# Altium schematic sheet FPGA_BANK_A.SchDoc
size A3; Organization: ICNS, MARCS Institute; Address1: Werrington South Campus, Great Western Highway; Address2: Werrington, NSW, 2747; SheetNumber: 3; SheetTotal: 16
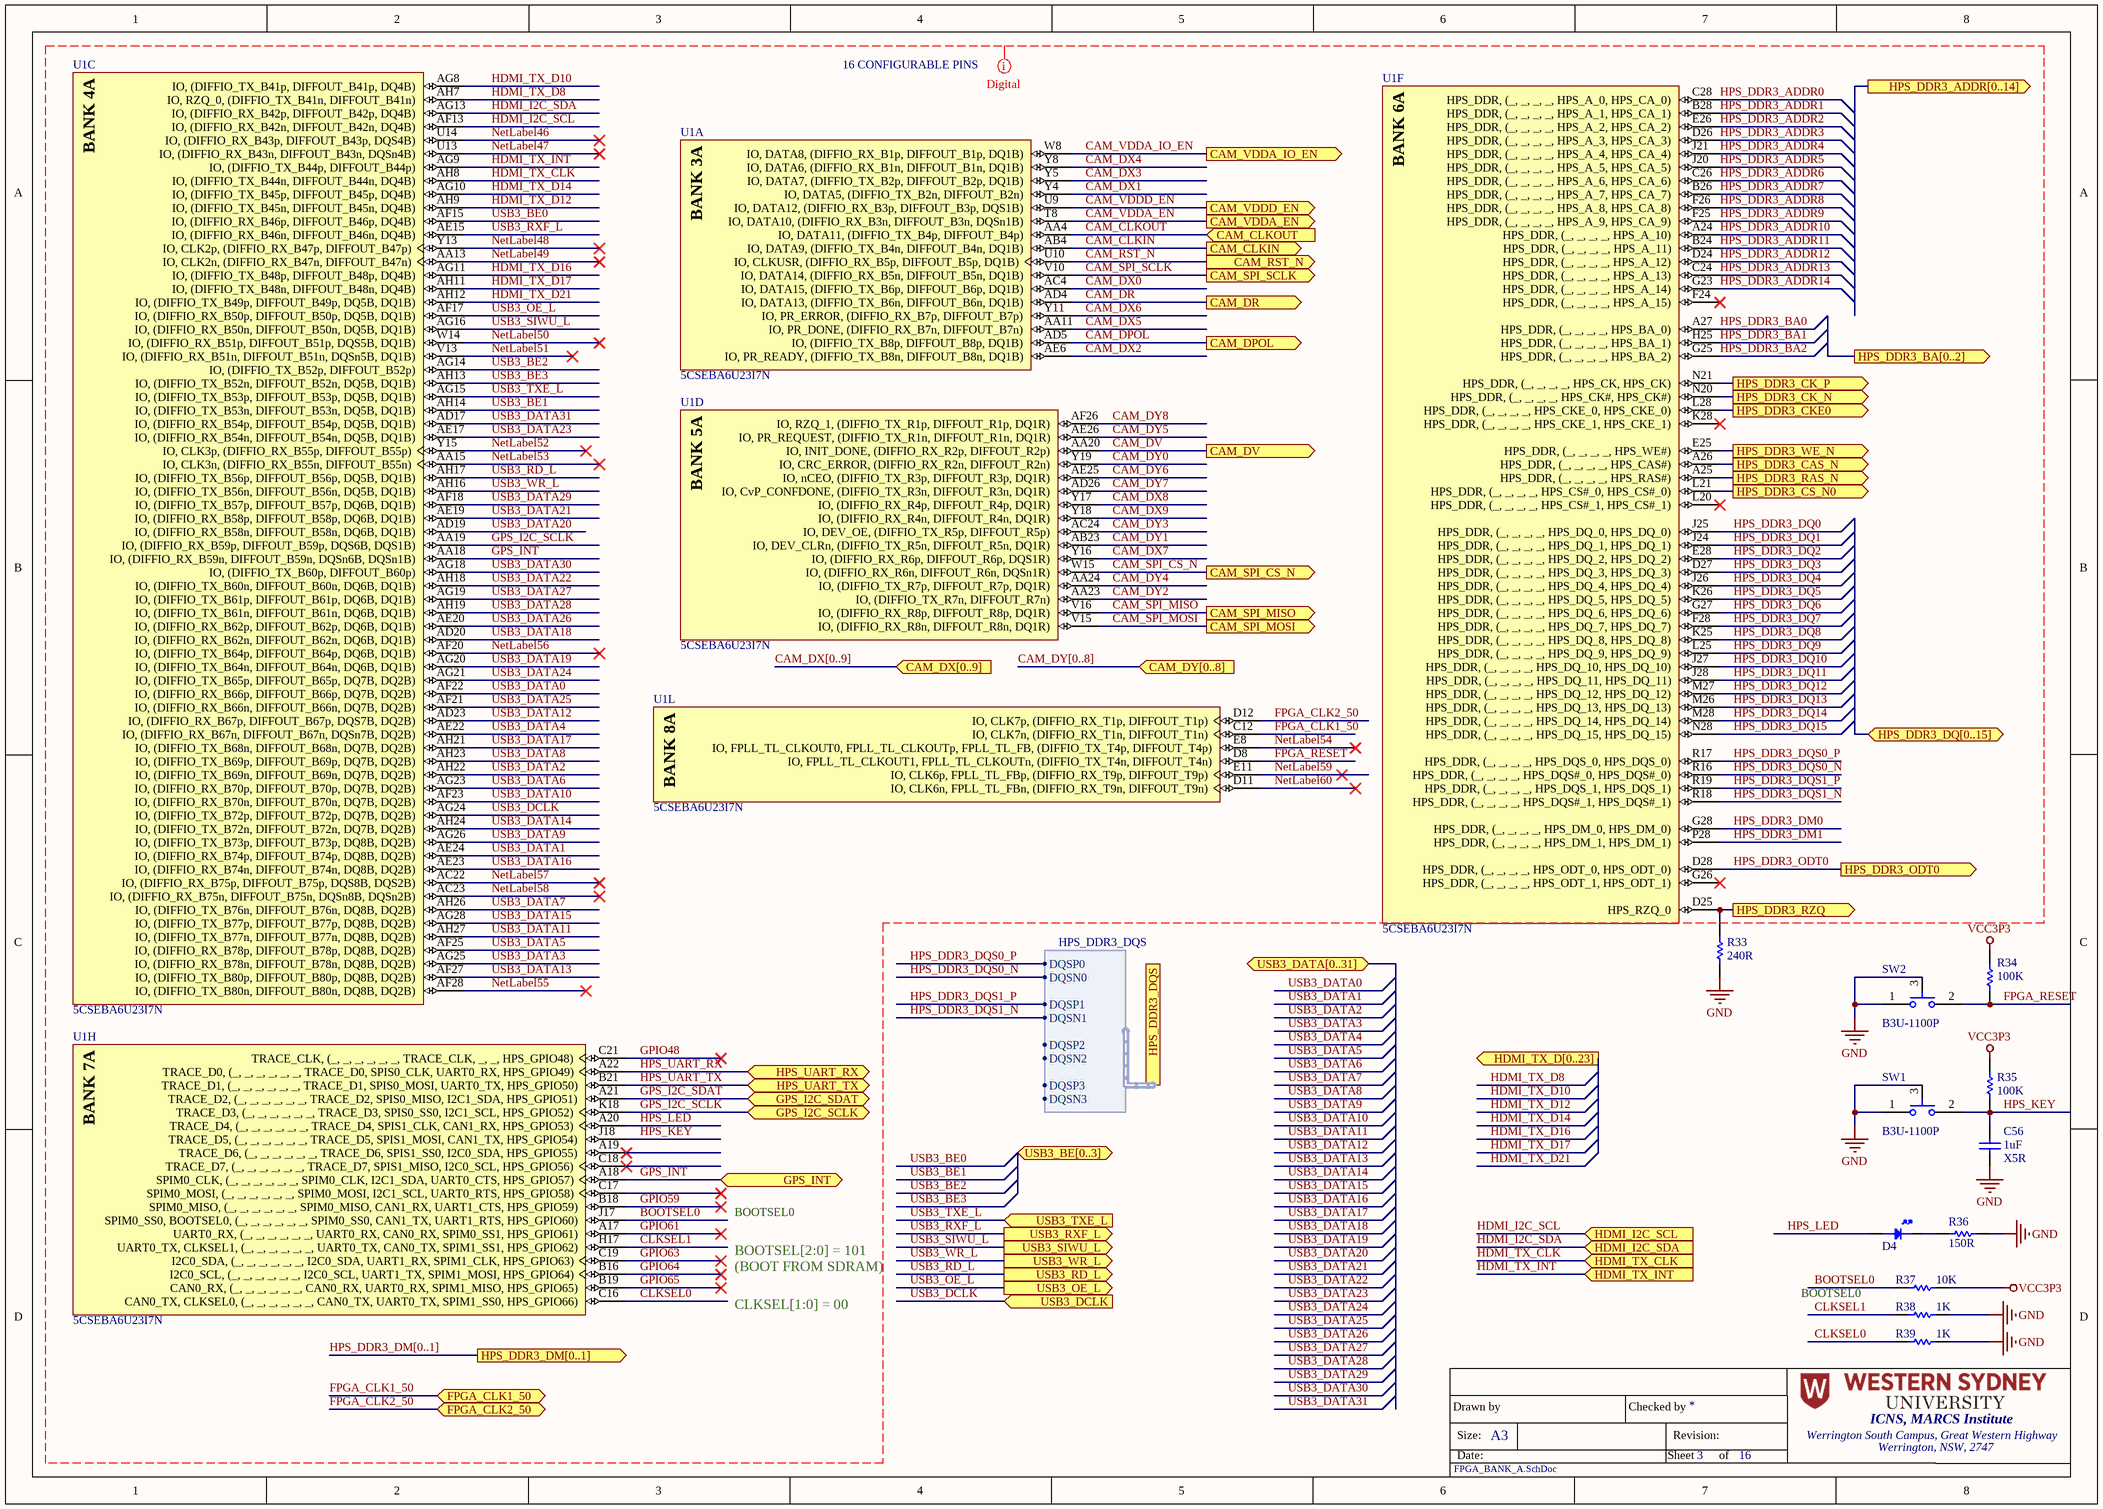
[diagram p0: FPGA_BANK_A.SchDoc]

## Parts
C56  value 1uF  Dielectric: X5R  [CAP 0201 (0603)]  (hidden comment: CL03A105KP3NSNC)
D4  150060SS75000  [DIOC 0603 (1608)]  (value not drawn)
R33  value 240R  [RES 0201 (0603)]  (hidden comment: AC0201FR-07240RL)
R34  value 100K  [RES 0402 (1005)]  (hidden comment: CRCW0402100KFKEDHP)
R35  value 100K  [RES 0402 (1005)]  (hidden comment: CRCW0402100KFKEDHP)
R36  Resistance: 150R  [RES 0603 (1608)]  (hidden comment: AC0603FR-10150RL)
R37  value 10K  [RES 0201 (0603)]  (hidden comment: AC0201FR-0710KL)
R38  value 1K  [RES 0201 (0603)]  (hidden comment: AC0201FR-071KL)
R39  value 1K  [RES 0201 (0603)]  (hidden comment: AC0201FR-071KL)
SW1  B3U-1100P  [FP-B3U-1100P-MFG]
SW2  B3U-1100P  [FP-B3U-1100P-MFG]
U1  5CSEBA6U23I7N  [ALTR-UBGA672_A-185]  (parts A,C,D,F,H,L of 21)

## Ports
CAM_CLKIN (out), CAM_CLKOUT (in), CAM_DPOL (out), CAM_DR (out), CAM_DV (out), CAM_DX[0..9] (in), CAM_DY[0..8] (in), CAM_RST_N (out), CAM_SPI_CS_N (out), CAM_SPI_MISO (out), CAM_SPI_MOSI (out), CAM_SPI_SCLK (out), CAM_VDDA_EN (out), CAM_VDDA_IO_EN (out), CAM_VDDD_EN (out), FPGA_CLK1_50 (bidir), FPGA_CLK2_50 (bidir), GPS_I2C_SCLK (bidir), GPS_I2C_SDAT (bidir), GPS_INT (bidir), HDMI_I2C_SCL (in), HDMI_I2C_SDA (in), HDMI_TX_CLK (in), HDMI_TX_D[0..23] (out), HDMI_TX_INT (in), HPS_DDR3_ADDR[0..14] (out), HPS_DDR3_BA[0..2] (out), HPS_DDR3_CAS_N (out), HPS_DDR3_CK_N (out), HPS_DDR3_CK_P (out), HPS_DDR3_CKE0 (out), HPS_DDR3_CS_N0 (out), HPS_DDR3_DM[0..1] (out), HPS_DDR3_DQ[0..15] (bidir), HPS_DDR3_DQS (harness HPS_DDR3_DQS), HPS_DDR3_ODT0 (out), HPS_DDR3_RAS_N (out), HPS_DDR3_RZQ (out), HPS_DDR3_WE_N (out), HPS_UART_RX (bidir), HPS_UART_TX (bidir), USB3_BE[0..3] (bidir), USB3_DATA[0..31] (bidir), USB3_DCLK (in), USB3_OE_L (out), USB3_RD_L (out), USB3_RXF_L (out), USB3_SIWU_L (out), USB3_TXE_L (in), USB3_WR_L (out)

## Harnesses
HPS_DDR3_DQS: DQSP0, DQSP1, DQSP2, DQSP3, DQSN0, DQSN1, DQSN2, DQSN3

## Nets
GND: C56.1 R33.2 R36.1 R38.2 R39.2 SW1.1 SW1.3 SW2.1 SW2.3
VCC3P3: R34.2 R35.2 R37.1
BOOTSEL0: R37.2 U1.J17(SPIM0_SS0,_BOOTSEL0,_(_,__,__,__,__,__,_SPIM0_SS0,_CAN1_TX,_UART1_RTS,_HPS_GPIO60))
CAM_CLKIN: U1.AB4(IO,_DATA9,_(DIFFIO_TX_B4n,_DIFFOUT_B4n,_DQ1B)) ; port CAM_CLKIN
CAM_CLKOUT: U1.AA4(IO,_DATA11,_(DIFFIO_TX_B4p,_DIFFOUT_B4p)) ; port CAM_CLKOUT
CAM_DPOL: U1.AD5(IO,_(DIFFIO_TX_B8p,_DIFFOUT_B8p,_DQ1B)) ; port CAM_DPOL
CAM_DR: U1.AD4(IO,_DATA13,_(DIFFIO_TX_B6n,_DIFFOUT_B6n,_DQ1B)) ; port CAM_DR
CAM_DV: U1.AA20(IO,_INIT_DONE,_(DIFFIO_RX_R2p,_DIFFOUT_R2p)) ; port CAM_DV
CAM_DX0: U1.AC4(IO,_DATA15,_(DIFFIO_TX_B6p,_DIFFOUT_B6p,_DQ1B))
CAM_DX1: U1.Y4(IO,_DATA5,_(DIFFIO_TX_B2n,_DIFFOUT_B2n))
CAM_DX2: U1.AE6(IO,_PR_READY,_(DIFFIO_TX_B8n,_DIFFOUT_B8n,_DQ1B))
CAM_DX3: U1.Y5(IO,_DATA7,_(DIFFIO_TX_B2p,_DIFFOUT_B2p,_DQ1B))
CAM_DX4: U1.Y8(IO,_DATA6,_(DIFFIO_RX_B1n,_DIFFOUT_B1n,_DQ1B))
CAM_DX5: U1.AA11(IO,_PR_DONE,_(DIFFIO_RX_B7n,_DIFFOUT_B7n))
CAM_DX6: U1.Y11(IO,_PR_ERROR,_(DIFFIO_RX_B7p,_DIFFOUT_B7p))
CAM_DX7: U1.Y16(IO,_(DIFFIO_RX_R6p,_DIFFOUT_R6p,_DQS1R))
CAM_DX8: U1.Y17(IO,_(DIFFIO_RX_R4p,_DIFFOUT_R4p,_DQ1R))
CAM_DX9: U1.Y18(IO,_(DIFFIO_RX_R4n,_DIFFOUT_R4n,_DQ1R))
CAM_DY0: U1.Y19(IO,_CRC_ERROR,_(DIFFIO_RX_R2n,_DIFFOUT_R2n))
CAM_DY1: U1.AB23(IO,_DEV_CLRn,_(DIFFIO_TX_R5n,_DIFFOUT_R5n,_DQ1R))
CAM_DY2: U1.AA23(IO,_(DIFFIO_TX_R7n,_DIFFOUT_R7n))
CAM_DY3: U1.AC24(IO,_DEV_OE,_(DIFFIO_TX_R5p,_DIFFOUT_R5p))
CAM_DY4: U1.AA24(IO,_(DIFFIO_TX_R7p,_DIFFOUT_R7p,_DQ1R))
CAM_DY5: U1.AE26(IO,_PR_REQUEST,_(DIFFIO_TX_R1n,_DIFFOUT_R1n,_DQ1R))
CAM_DY6: U1.AE25(IO,_nCEO,_(DIFFIO_TX_R3p,_DIFFOUT_R3p,_DQ1R))
CAM_DY7: U1.AD26(IO,_CvP_CONFDONE,_(DIFFIO_TX_R3n,_DIFFOUT_R3n,_DQ1R))
CAM_DY8: U1.AF26(IO,_RZQ_1,_(DIFFIO_TX_R1p,_DIFFOUT_R1p,_DQ1R))
CAM_RST_N: U1.U10(IO,_CLKUSR,_(DIFFIO_RX_B5p,_DIFFOUT_B5p,_DQ1B)) ; port CAM_RST_N
CAM_SPI_CS_N: U1.W15(IO,_(DIFFIO_RX_R6n,_DIFFOUT_R6n,_DQSn1R)) ; port CAM_SPI_CS_N
CAM_SPI_MISO: U1.V16(IO,_(DIFFIO_RX_R8p,_DIFFOUT_R8p,_DQ1R)) ; port CAM_SPI_MISO
CAM_SPI_MOSI: U1.V15(IO,_(DIFFIO_RX_R8n,_DIFFOUT_R8n,_DQ1R)) ; port CAM_SPI_MOSI
CAM_SPI_SCLK: U1.V10(IO,_DATA14,_(DIFFIO_RX_B5n,_DIFFOUT_B5n,_DQ1B)) ; port CAM_SPI_SCLK
CAM_VDDA_EN: U1.T8(IO,_DATA10,_(DIFFIO_RX_B3n,_DIFFOUT_B3n,_DQSn1B)) ; port CAM_VDDA_EN
CAM_VDDA_IO_EN: U1.W8(IO,_DATA8,_(DIFFIO_RX_B1p,_DIFFOUT_B1p,_DQ1B)) ; port CAM_VDDA_IO_EN
CAM_VDDD_EN: U1.U9(IO,_DATA12,_(DIFFIO_RX_B3p,_DIFFOUT_B3p,_DQS1B)) ; port CAM_VDDD_EN
CLKSEL0: R39.1 U1.C16(CAN0_TX,_CLKSEL0,_(_,__,__,__,__,__,_CAN0_TX,_UART0_TX,_SPIM1_SS0,_HPS_GPIO66))
CLKSEL1: R38.1 U1.H17(UART0_TX,_CLKSEL1,_(_,__,__,__,__,__,_UART0_TX,_CAN0_TX,_SPIM1_SS1,_HPS_GPIO62))
FPGA_CLK1_50: U1.C12(IO,_CLK7n,_(DIFFIO_RX_T1n,_DIFFOUT_T1n)) ; port FPGA_CLK1_50
FPGA_CLK2_50: U1.D12(IO,_CLK7p,_(DIFFIO_RX_T1p,_DIFFOUT_T1p)) ; port FPGA_CLK2_50
FPGA_RESET: R34.1 SW2.2 U1.D8(IO,_FPLL_TL_CLKOUT1,_FPLL_TL_CLKOUTn,_(DIFFIO_TX_T4n,_DIFFOUT_T4n))
GPIO48: U1.C21(TRACE_CLK,_(_,__,__,__,__,__,_TRACE_CLK,__,__,_HPS_GPIO48))
GPIO59: U1.B18(SPIM0_MISO,_(_,__,__,__,__,__,_SPIM0_MISO,_CAN1_RX,_UART1_CTS,_HPS_GPIO59))
GPIO61: U1.A17(UART0_RX,_(_,__,__,__,__,__,_UART0_RX,_CAN0_RX,_SPIM0_SS1,_HPS_GPIO61))
GPIO63: U1.C19(I2C0_SDA,_(_,__,__,__,__,__,_I2C0_SDA,_UART1_RX,_SPIM1_CLK,_HPS_GPIO63))
GPIO64: U1.B16(I2C0_SCL,_(_,__,__,__,__,__,_I2C0_SCL,_UART1_TX,_SPIM1_MOSI,_HPS_GPIO64))
GPIO65: U1.B19(CAN0_RX,_(_,__,__,__,__,__,_CAN0_RX,_UART0_RX,_SPIM1_MISO,_HPS_GPIO65))
GPS_I2C_SCLK: U1.AA19(IO,_(DIFFIO_RX_B59p,_DIFFOUT_B59p,_DQS6B,_DQS1B)) U1.K18(TRACE_D3,_(_,__,__,__,__,__,_TRACE_D3,_SPIS0_SS0,_I2C1_SCL,_HPS_GPIO52)) ; port GPS_I2C_SCLK
GPS_I2C_SDAT: U1.A21(TRACE_D2,_(_,__,__,__,__,__,_TRACE_D2,_SPIS0_MISO,_I2C1_SDA,_HPS_GPIO51)) ; port GPS_I2C_SDAT
GPS_INT: U1.A18(SPIM0_CLK,_(_,__,__,__,__,__,_SPIM0_CLK,_I2C1_SDA,_UART0_CTS,_HPS_GPIO57)) U1.AA18(IO,_(DIFFIO_RX_B59n,_DIFFOUT_B59n,_DQSn6B,_DQSn1B)) ; port GPS_INT
HDMI_I2C_SCL: U1.AF13(IO,_(DIFFIO_RX_B42n,_DIFFOUT_B42n,_DQ4B)) ; port HDMI_I2C_SCL
HDMI_I2C_SDA: U1.AG13(IO,_(DIFFIO_RX_B42p,_DIFFOUT_B42p,_DQ4B)) ; port HDMI_I2C_SDA
HDMI_TX_CLK: U1.AH8(IO,_(DIFFIO_TX_B44n,_DIFFOUT_B44n,_DQ4B)) ; port HDMI_TX_CLK
HDMI_TX_D8: U1.AH7(IO,_RZQ_0,_(DIFFIO_TX_B41n,_DIFFOUT_B41n))
HDMI_TX_D10: U1.AG8(IO,_(DIFFIO_TX_B41p,_DIFFOUT_B41p,_DQ4B))
HDMI_TX_D12: U1.AH9(IO,_(DIFFIO_TX_B45n,_DIFFOUT_B45n,_DQ4B))
HDMI_TX_D14: U1.AG10(IO,_(DIFFIO_TX_B45p,_DIFFOUT_B45p,_DQ4B))
HDMI_TX_D16: U1.AG11(IO,_(DIFFIO_TX_B48p,_DIFFOUT_B48p,_DQ4B))
HDMI_TX_D17: U1.AH11(IO,_(DIFFIO_TX_B48n,_DIFFOUT_B48n,_DQ4B))
HDMI_TX_D21: U1.AH12(IO,_(DIFFIO_TX_B49p,_DIFFOUT_B49p,_DQ5B,_DQ1B))
HDMI_TX_INT: U1.AG9(IO,_(DIFFIO_TX_B44p,_DIFFOUT_B44p)) ; port HDMI_TX_INT
HPS_DDR3_ADDR0: U1.C28(HPS_DDR,_(_,__,__,__,_HPS_A_0,_HPS_CA_0))
HPS_DDR3_ADDR1: U1.B28(HPS_DDR,_(_,__,__,__,_HPS_A_1,_HPS_CA_1))
HPS_DDR3_ADDR2: U1.E26(HPS_DDR,_(_,__,__,__,_HPS_A_2,_HPS_CA_2))
HPS_DDR3_ADDR3: U1.D26(HPS_DDR,_(_,__,__,__,_HPS_A_3,_HPS_CA_3))
HPS_DDR3_ADDR4: U1.J21(HPS_DDR,_(_,__,__,__,_HPS_A_4,_HPS_CA_4))
HPS_DDR3_ADDR5: U1.J20(HPS_DDR,_(_,__,__,__,_HPS_A_5,_HPS_CA_5))
HPS_DDR3_ADDR6: U1.C26(HPS_DDR,_(_,__,__,__,_HPS_A_6,_HPS_CA_6))
HPS_DDR3_ADDR7: U1.B26(HPS_DDR,_(_,__,__,__,_HPS_A_7,_HPS_CA_7))
HPS_DDR3_ADDR8: U1.F26(HPS_DDR,_(_,__,__,__,_HPS_A_8,_HPS_CA_8))
HPS_DDR3_ADDR9: U1.F25(HPS_DDR,_(_,__,__,__,_HPS_A_9,_HPS_CA_9))
HPS_DDR3_ADDR10: U1.A24(HPS_DDR,_(_,__,__,__,_HPS_A_10))
HPS_DDR3_ADDR11: U1.B24(HPS_DDR,_(_,__,__,__,_HPS_A_11))
HPS_DDR3_ADDR12: U1.D24(HPS_DDR,_(_,__,__,__,_HPS_A_12))
HPS_DDR3_ADDR13: U1.C24(HPS_DDR,_(_,__,__,__,_HPS_A_13))
HPS_DDR3_ADDR14: U1.G23(HPS_DDR,_(_,__,__,__,_HPS_A_14))
HPS_DDR3_BA0: U1.A27(HPS_DDR,_(_,__,__,__,_HPS_BA_0))
HPS_DDR3_BA1: U1.H25(HPS_DDR,_(_,__,__,__,_HPS_BA_1))
HPS_DDR3_BA2: U1.G25(HPS_DDR,_(_,__,__,__,_HPS_BA_2))
HPS_DDR3_CAS_N: U1.A26(HPS_DDR,_(_,__,__,__,_HPS_CAS#)) ; port HPS_DDR3_CAS_N
HPS_DDR3_CK_N: U1.N20(HPS_DDR,_(_,__,__,__,_HPS_CK#,_HPS_CK#)) ; port HPS_DDR3_CK_N
HPS_DDR3_CK_P: U1.N21(HPS_DDR,_(_,__,__,__,_HPS_CK,_HPS_CK)) ; port HPS_DDR3_CK_P
HPS_DDR3_CKE0: U1.L28(HPS_DDR,_(_,__,__,__,_HPS_CKE_0,_HPS_CKE_0)) ; port HPS_DDR3_CKE0
HPS_DDR3_CS_N0: U1.L21(HPS_DDR,_(_,__,__,__,_HPS_CS#_0,_HPS_CS#_0)) ; port HPS_DDR3_CS_N0
HPS_DDR3_DM0: U1.G28(HPS_DDR,_(_,__,__,__,_HPS_DM_0,_HPS_DM_0))
HPS_DDR3_DM1: U1.P28(HPS_DDR,_(_,__,__,__,_HPS_DM_1,_HPS_DM_1))
HPS_DDR3_DQ0: U1.J25(HPS_DDR,_(_,__,__,__,_HPS_DQ_0,_HPS_DQ_0))
HPS_DDR3_DQ1: U1.J24(HPS_DDR,_(_,__,__,__,_HPS_DQ_1,_HPS_DQ_1))
HPS_DDR3_DQ2: U1.E28(HPS_DDR,_(_,__,__,__,_HPS_DQ_2,_HPS_DQ_2))
HPS_DDR3_DQ3: U1.D27(HPS_DDR,_(_,__,__,__,_HPS_DQ_3,_HPS_DQ_3))
HPS_DDR3_DQ4: U1.J26(HPS_DDR,_(_,__,__,__,_HPS_DQ_4,_HPS_DQ_4))
HPS_DDR3_DQ5: U1.K26(HPS_DDR,_(_,__,__,__,_HPS_DQ_5,_HPS_DQ_5))
HPS_DDR3_DQ6: U1.G27(HPS_DDR,_(_,__,__,__,_HPS_DQ_6,_HPS_DQ_6))
HPS_DDR3_DQ7: U1.F28(HPS_DDR,_(_,__,__,__,_HPS_DQ_7,_HPS_DQ_7))
HPS_DDR3_DQ8: U1.K25(HPS_DDR,_(_,__,__,__,_HPS_DQ_8,_HPS_DQ_8))
HPS_DDR3_DQ9: U1.L25(HPS_DDR,_(_,__,__,__,_HPS_DQ_9,_HPS_DQ_9))
HPS_DDR3_DQ10: U1.J27(HPS_DDR,_(_,__,__,__,_HPS_DQ_10,_HPS_DQ_10))
HPS_DDR3_DQ11: U1.J28(HPS_DDR,_(_,__,__,__,_HPS_DQ_11,_HPS_DQ_11))
HPS_DDR3_DQ12: U1.M27(HPS_DDR,_(_,__,__,__,_HPS_DQ_12,_HPS_DQ_12))
HPS_DDR3_DQ13: U1.M26(HPS_DDR,_(_,__,__,__,_HPS_DQ_13,_HPS_DQ_13))
HPS_DDR3_DQ14: U1.M28(HPS_DDR,_(_,__,__,__,_HPS_DQ_14,_HPS_DQ_14))
HPS_DDR3_DQ15: U1.N28(HPS_DDR,_(_,__,__,__,_HPS_DQ_15,_HPS_DQ_15))
HPS_DDR3_DQS0_N: U1.R16(HPS_DDR,_(_,__,__,__,_HPS_DQS#_0,_HPS_DQS#_0)) ; port HPS_DDR3_DQS.DQSN0
HPS_DDR3_DQS0_P: U1.R17(HPS_DDR,_(_,__,__,__,_HPS_DQS_0,_HPS_DQS_0)) ; port HPS_DDR3_DQS.DQSP0
HPS_DDR3_DQS1_N: U1.R18(HPS_DDR,_(_,__,__,__,_HPS_DQS#_1,_HPS_DQS#_1)) ; port HPS_DDR3_DQS.DQSN1
HPS_DDR3_DQS1_P: U1.R19(HPS_DDR,_(_,__,__,__,_HPS_DQS_1,_HPS_DQS_1)) ; port HPS_DDR3_DQS.DQSP1
HPS_DDR3_ODT0: U1.D28(HPS_DDR,_(_,__,__,__,_HPS_ODT_0,_HPS_ODT_0)) ; port HPS_DDR3_ODT0
HPS_DDR3_RAS_N: U1.A25(HPS_DDR,_(_,__,__,__,_HPS_RAS#)) ; port HPS_DDR3_RAS_N
HPS_DDR3_RZQ: R33.1 U1.D25(HPS_RZQ_0) ; port HPS_DDR3_RZQ
HPS_DDR3_WE_N: U1.E25(HPS_DDR,_(_,__,__,__,_HPS_WE#)) ; port HPS_DDR3_WE_N
HPS_KEY: C56.2 R35.1 SW1.2 U1.J18(TRACE_D5,_(_,__,__,__,__,__,_TRACE_D5,_SPIS1_MOSI,_CAN1_TX,_HPS_GPIO54))
HPS_LED: D4.2(A) U1.A20(TRACE_D4,_(_,__,__,__,__,__,_TRACE_D4,_SPIS1_CLK,_CAN1_RX,_HPS_GPIO53))
HPS_UART_RX: U1.A22(TRACE_D0,_(_,__,__,__,__,__,_TRACE_D0,_SPIS0_CLK,_UART0_RX,_HPS_GPIO49)) ; port HPS_UART_RX
HPS_UART_TX: U1.B21(TRACE_D1,_(_,__,__,__,__,__,_TRACE_D1,_SPIS0_MOSI,_UART0_TX,_HPS_GPIO50)) ; port HPS_UART_TX
NetLabel46: U1.U14(IO,_(DIFFIO_RX_B43p,_DIFFOUT_B43p,_DQS4B))
NetLabel47: U1.U13(IO,_(DIFFIO_RX_B43n,_DIFFOUT_B43n,_DQSn4B))
NetLabel48: U1.Y13(IO,_CLK2p,_(DIFFIO_RX_B47p,_DIFFOUT_B47p))
NetLabel49: U1.AA13(IO,_CLK2n,_(DIFFIO_RX_B47n,_DIFFOUT_B47n))
NetLabel50: U1.W14(IO,_(DIFFIO_RX_B51p,_DIFFOUT_B51p,_DQS5B,_DQ1B))
NetLabel51: U1.V13(IO,_(DIFFIO_RX_B51n,_DIFFOUT_B51n,_DQSn5B,_DQ1B))
NetLabel52: U1.Y15(IO,_CLK3p,_(DIFFIO_RX_B55p,_DIFFOUT_B55p))
NetLabel53: U1.AA15(IO,_CLK3n,_(DIFFIO_RX_B55n,_DIFFOUT_B55n))
NetLabel54: U1.E8(IO,_FPLL_TL_CLKOUT0,_FPLL_TL_CLKOUTp,_FPLL_TL_FB,_(DIFFIO_TX_T4p,_DIFFOUT_T4p))
NetLabel55: U1.AF28(IO,_(DIFFIO_TX_B80n,_DIFFOUT_B80n,_DQ8B,_DQ2B))
NetLabel56: U1.AF20(IO,_(DIFFIO_TX_B64p,_DIFFOUT_B64p,_DQ6B,_DQ1B))
NetLabel57: U1.AC22(IO,_(DIFFIO_RX_B75p,_DIFFOUT_B75p,_DQS8B,_DQS2B))
NetLabel58: U1.AC23(IO,_(DIFFIO_RX_B75n,_DIFFOUT_B75n,_DQSn8B,_DQSn2B))
NetLabel59: U1.E11(IO,_CLK6p,_FPLL_TL_FBp,_(DIFFIO_RX_T9p,_DIFFOUT_T9p))
NetLabel60: U1.D11(IO,_CLK6n,_FPLL_TL_FBn,_(DIFFIO_RX_T9n,_DIFFOUT_T9n))
USB3_BE0: U1.AF15(IO,_(DIFFIO_RX_B46p,_DIFFOUT_B46p,_DQ4B))
USB3_BE1: U1.AH14(IO,_(DIFFIO_TX_B53n,_DIFFOUT_B53n,_DQ5B,_DQ1B))
USB3_BE2: U1.AG14(IO,_(DIFFIO_TX_B52p,_DIFFOUT_B52p))
USB3_BE3: U1.AH13(IO,_(DIFFIO_TX_B52n,_DIFFOUT_B52n,_DQ5B,_DQ1B))
USB3_DATA0: U1.AF22(IO,_(DIFFIO_RX_B66p,_DIFFOUT_B66p,_DQ7B,_DQ2B))
USB3_DATA1: U1.AE24(IO,_(DIFFIO_RX_B74p,_DIFFOUT_B74p,_DQ8B,_DQ2B))
USB3_DATA2: U1.AH22(IO,_(DIFFIO_TX_B69n,_DIFFOUT_B69n,_DQ7B,_DQ2B))
USB3_DATA3: U1.AG25(IO,_(DIFFIO_RX_B78n,_DIFFOUT_B78n,_DQ8B,_DQ2B))
USB3_DATA4: U1.AE22(IO,_(DIFFIO_RX_B67n,_DIFFOUT_B67n,_DQSn7B,_DQ2B))
USB3_DATA5: U1.AF25(IO,_(DIFFIO_RX_B78p,_DIFFOUT_B78p,_DQ8B,_DQ2B))
USB3_DATA6: U1.AG23(IO,_(DIFFIO_RX_B70p,_DIFFOUT_B70p,_DQ7B,_DQ2B))
USB3_DATA7: U1.AH26(IO,_(DIFFIO_TX_B76n,_DIFFOUT_B76n,_DQ8B,_DQ2B))
USB3_DATA8: U1.AH23(IO,_(DIFFIO_TX_B69p,_DIFFOUT_B69p,_DQ7B,_DQ2B))
USB3_DATA9: U1.AG26(IO,_(DIFFIO_TX_B73p,_DIFFOUT_B73p,_DQ8B,_DQ2B))
USB3_DATA10: U1.AF23(IO,_(DIFFIO_RX_B70n,_DIFFOUT_B70n,_DQ7B,_DQ2B))
USB3_DATA11: U1.AH27(IO,_(DIFFIO_TX_B77n,_DIFFOUT_B77n,_DQ8B,_DQ2B))
USB3_DATA12: U1.AD23(IO,_(DIFFIO_RX_B67p,_DIFFOUT_B67p,_DQS7B,_DQ2B))
USB3_DATA13: U1.AF27(IO,_(DIFFIO_TX_B80p,_DIFFOUT_B80p,_DQ8B,_DQ2B))
USB3_DATA14: U1.AH24(IO,_(DIFFIO_TX_B72n,_DIFFOUT_B72n,_DQ7B,_DQ2B))
USB3_DATA15: U1.AG28(IO,_(DIFFIO_TX_B77p,_DIFFOUT_B77p,_DQ8B,_DQ2B))
USB3_DATA16: U1.AE23(IO,_(DIFFIO_RX_B74n,_DIFFOUT_B74n,_DQ8B,_DQ2B))
USB3_DATA17: U1.AH21(IO,_(DIFFIO_TX_B68n,_DIFFOUT_B68n,_DQ7B,_DQ2B))
USB3_DATA18: U1.AD20(IO,_(DIFFIO_RX_B62n,_DIFFOUT_B62n,_DQ6B,_DQ1B))
USB3_DATA19: U1.AG20(IO,_(DIFFIO_TX_B64n,_DIFFOUT_B64n,_DQ6B,_DQ1B))
USB3_DATA20: U1.AD19(IO,_(DIFFIO_RX_B58n,_DIFFOUT_B58n,_DQ6B,_DQ1B))
USB3_DATA21: U1.AE19(IO,_(DIFFIO_RX_B58p,_DIFFOUT_B58p,_DQ6B,_DQ1B))
USB3_DATA22: U1.AH18(IO,_(DIFFIO_TX_B60n,_DIFFOUT_B60n,_DQ6B,_DQ1B))
USB3_DATA23: U1.AE17(IO,_(DIFFIO_RX_B54n,_DIFFOUT_B54n,_DQ5B,_DQ1B))
USB3_DATA24: U1.AG21(IO,_(DIFFIO_TX_B65p,_DIFFOUT_B65p,_DQ7B,_DQ2B))
USB3_DATA25: U1.AF21(IO,_(DIFFIO_RX_B66n,_DIFFOUT_B66n,_DQ7B,_DQ2B))
USB3_DATA26: U1.AE20(IO,_(DIFFIO_RX_B62p,_DIFFOUT_B62p,_DQ6B,_DQ1B))
USB3_DATA27: U1.AG19(IO,_(DIFFIO_TX_B61p,_DIFFOUT_B61p,_DQ6B,_DQ1B))
USB3_DATA28: U1.AH19(IO,_(DIFFIO_TX_B61n,_DIFFOUT_B61n,_DQ6B,_DQ1B))
USB3_DATA29: U1.AF18(IO,_(DIFFIO_TX_B57p,_DIFFOUT_B57p,_DQ6B,_DQ1B))
USB3_DATA30: U1.AG18(IO,_(DIFFIO_TX_B60p,_DIFFOUT_B60p))
USB3_DATA31: U1.AD17(IO,_(DIFFIO_RX_B54p,_DIFFOUT_B54p,_DQ5B,_DQ1B))
USB3_DCLK: U1.AG24(IO,_(DIFFIO_TX_B72p,_DIFFOUT_B72p,_DQ7B,_DQ2B)) ; port USB3_DCLK
USB3_OE_L: U1.AF17(IO,_(DIFFIO_RX_B50p,_DIFFOUT_B50p,_DQ5B,_DQ1B)) ; port USB3_OE_L
USB3_RD_L: U1.AH17(IO,_(DIFFIO_TX_B56p,_DIFFOUT_B56p,_DQ5B,_DQ1B)) ; port USB3_RD_L
USB3_RXF_L: U1.AE15(IO,_(DIFFIO_RX_B46n,_DIFFOUT_B46n,_DQ4B)) ; port USB3_RXF_L
USB3_SIWU_L: U1.AG16(IO,_(DIFFIO_RX_B50n,_DIFFOUT_B50n,_DQ5B,_DQ1B)) ; port USB3_SIWU_L
USB3_TXE_L: U1.AG15(IO,_(DIFFIO_TX_B53p,_DIFFOUT_B53p,_DQ5B,_DQ1B)) ; port USB3_TXE_L
USB3_WR_L: U1.AH16(IO,_(DIFFIO_TX_B56n,_DIFFOUT_B56n,_DQ5B,_DQ1B)) ; port USB3_WR_L
NetD4_1: D4.1(K) R36.2

Not connected (* = marked no-connect by the designer): U1 A19(TRACE_D6,_(_,__,__,__,__,__,_TRACE_D6,_SPIS1_SS0,_I2C0_SDA,_HPS_GPIO55))* C17(SPIM0_MOSI,_(_,__,__,__,__,__,_SPIM0_MOSI,_I2C1_SCL,_UART0_RTS,_HPS_GPIO58))* C18(TRACE_D7,_(_,__,__,__,__,__,_TRACE_D7,_SPIS1_MISO,_I2C0_SCL,_HPS_GPIO56))* F24(HPS_DDR,_(_,__,__,__,_HPS_A_15))* G26(HPS_DDR,_(_,__,__,__,_HPS_ODT_1,_HPS_ODT_1))* K28(HPS_DDR,_(_,__,__,__,_HPS_CKE_1,_HPS_CKE_1))* L20(HPS_DDR,_(_,__,__,__,_HPS_CS#_1,_HPS_CS#_1))*

## Buses and harness runs
bus CAM_DX[0..9] = port CAM_DX[0..9]
bus CAM_DY[0..8] = port CAM_DY[0..8]
bus HPS_DDR3_DM[0..1] = port HPS_DDR3_DM[0..1]

## Layout directives
net class DIGITAL: BOOTSEL0, CAM_CLKIN, CAM_CLKOUT, CAM_DPOL, CAM_DR, CAM_DV, CAM_DX0, CAM_DX1, CAM_DX2, CAM_DX3, CAM_DX4, CAM_DX5, CAM_DX6, CAM_DX7, CAM_DX8, CAM_DX9, CAM_DX[0..9], CAM_DY0, CAM_DY1, CAM_DY2, CAM_DY3, CAM_DY4, CAM_DY5, CAM_DY6, CAM_DY7, CAM_DY8, CAM_DY[0..8], CAM_RST_N, CAM_SPI_CS_N, CAM_SPI_MISO, CAM_SPI_MOSI, CAM_SPI_SCLK, CAM_VDDA_EN, CAM_VDDA_IO_EN, CAM_VDDD_EN, CLKSEL0, CLKSEL1, FPGA_CLK1_50, FPGA_CLK2_50, FPGA_RESET, GPIO48, GPIO59, GPIO61, GPIO63, GPIO64, GPIO65, GPS_I2C_SCLK, GPS_I2C_SDAT, GPS_INT, HDMI_I2C_SCL, HDMI_I2C_SDA, HDMI_TX_CLK, HDMI_TX_D8, HDMI_TX_D10, HDMI_TX_D12, HDMI_TX_D14, HDMI_TX_D16, HDMI_TX_D17, HDMI_TX_D21, HDMI_TX_INT, HPS_DDR3_ADDR0, HPS_DDR3_ADDR1, HPS_DDR3_ADDR2, HPS_DDR3_ADDR3, HPS_DDR3_ADDR4, HPS_DDR3_ADDR5, HPS_DDR3_ADDR6, HPS_DDR3_ADDR7, HPS_DDR3_ADDR8, HPS_DDR3_ADDR9, HPS_DDR3_ADDR10, HPS_DDR3_ADDR11, HPS_DDR3_ADDR12, HPS_DDR3_ADDR13, HPS_DDR3_ADDR14, HPS_DDR3_BA0, HPS_DDR3_BA1, HPS_DDR3_BA2, HPS_DDR3_DM0, HPS_DDR3_DM1, HPS_DDR3_DM[0..1], HPS_DDR3_DQ0, HPS_DDR3_DQ1, HPS_DDR3_DQ2, HPS_DDR3_DQ3, HPS_DDR3_DQ4, HPS_DDR3_DQ5, HPS_DDR3_DQ6, HPS_DDR3_DQ7, HPS_DDR3_DQ8, HPS_DDR3_DQ9, HPS_DDR3_DQ10, HPS_DDR3_DQ11, HPS_DDR3_DQ12, HPS_DDR3_DQ13, HPS_DDR3_DQ14, HPS_DDR3_DQ15, HPS_DDR3_DQS0_N, HPS_DDR3_DQS0_P, HPS_DDR3_DQS1_N, HPS_DDR3_DQS1_P, HPS_DDR3_ODT0, HPS_KEY, HPS_LED, HPS_UART_RX, HPS_UART_TX, NetLabel46, NetLabel47, NetLabel48, NetLabel49, NetLabel50, NetLabel51, NetLabel52, NetLabel53, NetLabel54, NetLabel55, NetLabel56, NetLabel57, NetLabel58, NetLabel59, NetLabel60, USB3_BE0, USB3_BE1, USB3_BE2, USB3_BE3, USB3_DATA0, USB3_DATA1, USB3_DATA2, USB3_DATA3, USB3_DATA4, USB3_DATA5, USB3_DATA6, USB3_DATA7, USB3_DATA8, USB3_DATA9, USB3_DATA10, USB3_DATA11, USB3_DATA12, USB3_DATA13, USB3_DATA14, USB3_DATA15, USB3_DATA16, USB3_DATA17, USB3_DATA18, USB3_DATA19, USB3_DATA20, USB3_DATA21, USB3_DATA22, USB3_DATA23, USB3_DATA24, USB3_DATA25, USB3_DATA26, USB3_DATA27, USB3_DATA28, USB3_DATA29, USB3_DATA30, USB3_DATA31, USB3_DCLK, USB3_OE_L, USB3_RD_L, USB3_RXF_L, USB3_SIWU_L, USB3_TXE_L, USB3_WR_L

## Notes on the sheet
- 16 CONFIGURABLE PINS
- BOOTSEL0
- BOOTSEL[2:0] = 101 (BOOT FROM SDRAM)
- CLKSEL[1:0] = 00
- Drawn by
- Size:
- Date:
- A3
- Checked by
- Sheet
- Revision:
- of
- (in symbol CMP-005-000007-1, part A) BANK 3A
- (in symbol CMP-005-000007-1, part C) BANK 4A
- (in symbol CMP-005-000007-1, part D) BANK 5A
- (in symbol CMP-005-000007-1, part F) BANK 6A
- (in symbol CMP-005-000007-1, part H) BANK 7A
- (in symbol CMP-005-000007-1, part L) BANK 8A

## Library data of the parts
C56 = CMP-003-000015-1: Cap Ceramic 1uF 10V X5R 10% Pad SMD 0201 85C T/R; Manufacturer: Samsung; Capacitance: 1uF; Tolerance: 10%; Category: Ceramic Capacitors; Packaging: Cut Tape; Voltage Rating: 10V; Mount: Surface Mount; Length: 0.024inch; Case Code (Metric): 0603; Case Code (Imperial): 0201; Case/Package: 0201; RoHS Compliant: Yes; ComponentLink1URL: http://www.samsungsem.com/kr/support/product-search/mlcc/CL03A105KP3NSNC.jsp?src-supplier=Digi-Key; RoHS: Yes; Pricing 1: 10000=0.06202, 20000=0.05883 (USD); Thickness: 0.013inch; Design Item ID: CL03A105KP3NSNC; Min Operating Temperature: -55°C; Manufacturer Part Number: CL03A105KP3NSNC; Max Operating Temperature: 85°C; Source: ICNS_PropheseeLib.SchLib; Width: 0.012inch; Stock 1: 3449211; ComponentLink1Description: http://www.samsungsem.com/kr/support/product-search/mlcc/CL03A105KP3NSNC.jsp?src-supplier=Digi-Key
D4 = CMP-004-000014-1: Led, Red, 630 Nm, 1.9 V, 20mA, 30 Ma, 60 Mcd Rohs Compliant: Yes; Manufacturer 1: Wurth Electronics; Viewing Angle: 140°; Wavelength: 630nm; Luminous Intensity: 60mcd; Forward Voltage: 1.9V; Forward Current: 30mA; Lens Style: Clear,Rectangular; Description 1: Led, Red, 630 Nm, 1.9 V, 30 Ma, 60 Mcd Rohs Compliant: Yes; Height: 0.7mm; Case/Package: 0603; Case Code (Metric): 1608; Width: 0.8mm; Case Code (Imperial): 0603; Min Operating Temperature: -40°C; Mount: Surface Mount; REACH SVHC: Unknown; Packaging: Tape and Reel; Color: Red; Test Current: 20mA; Max Operating Temperature: 85°C; Package Quantity: 4000; Dominant Wavelength: 630nm; Length: 1.6mm; RoHS Compliant: Yes; ComponentLink3Description: https://datasheet.ciiva.com/48430/150060ss75000-eng-tds-48430042.pdf?src-supplier=Distrelec; RoHS: Yes; Stock 1: 25645; Source: ICNS_PropheseeLib.SchLib; ComponentLink2Description: https://datasheet.ciiva.com/29279/759429-da-01-en-chipled-0603-w-kl-s-rot-150060ss75000-29279208.pdf?src-supplier=Conrad; ComponentLink1URL: https://datasheet.ciiva.com/23843/150060ss75000-23843248.pdf?src-supplier=Newark; Category: LEDs; ComponentLink3URL: https://datasheet.ciiva.com/48430/150060ss75000-eng-tds-48430042.pdf?src-supplier=Distrelec; ComponentLink1Description: https://datasheet.ciiva.com/23843/150060ss75000-23843248.pdf?src-supplier=Newark; Pricing 1: 1=0.15000, 50=0.13800, 100=0.11800, 500=0.10200 (USD); Design Item ID: 150060SS75000; ComponentLink2URL: https://datasheet.ciiva.com/29279/759429-da-01-en-chipled-0603-w-kl-s-rot-150060ss75000-29279208.pdf?src-supplier=Conrad; Manufacturer Part Number 1: 150060SS75000
R33 = CMP-006-000023-1: Res Thick Film 0201 240 Ohm 1% 0.05W(1/20W) ±200ppm/C Pad SMD Automotive T/R; Manufacturer: Yageo; Temperature Coefficient: 200ppm/°C; Max Power Dissipation: 50mW; Case/Package: 0201; Max Operating Temperature: 155°C; Packaging: Tape and Reel; Source: ICNS_PropheseeLib.SchLib; RoHS: Yes; Pricing 1: 1=0.10000, 10=0.06600, 100=0.02670, 1000=0.01201, 2500=0.01042, 5000=0.00861 (USD); ComponentLink1Description: http://www.yageo.com/NewPortal/yageodocoutput?fileName=/pdf/R-Chip/PYu-AC_51_RoHS_L_6.pdf&src-supplier=Digi-Key; Features: Moisture Resistant,Automotive AEC-Q200; Case Code (Metric): 0603; Design Item ID: AC0201FR-07240RL; RoHS Compliant: Yes; Tolerance: 1%; Resistance: 240R; Stock 1: 26116; Width: 0.012inch; Min Operating Temperature: -55°C; Category: Chip SMD Resistors; Case Code (Imperial): 0201; Manufacturer Part Number: AC0201FR-07240RL; Resistor Type: Thick Film; Height: 0.01inch; ComponentLink1URL: http://www.yageo.com/NewPortal/yageodocoutput?fileName=/pdf/R-Chip/PYu-AC_51_RoHS_L_6.pdf&src-supplier=Digi-Key; Length: 0.024inch; Number of Terminations: 2
R34 R35 = CMP-006-000009-1: Res Thick Film 0402 100K Ohm 1% 0.2W(1/5W) ±100ppm/C Pad SMD Automotive T/R; Manufacturer 1: Vishay Dale; Resistance: 100kR; Temperature Coefficient: 100ppm/°C; Max Power Dissipation: 125mW; Voltage Rating (DC): 50V; ComponentLink1URL: https://datasheet.ciiva.com/2498/crcwhpe3-2498716.pdf?src-supplier=Digi-Key; ComponentLink5URL: https://datasheet.ciiva.com/48525/crcwhpe3-48525582.pdf?src-supplier=Avnet; Tolerance: 1%; Height: 0.3mm; Features: Automotive AEC-Q200; Mount: Surface Mount; RoHS: Yes; Series: CRCW-HP; Lead Free: Lead Free; REACH SVHC: Unknown; Case Code (Metric): 1005; ComponentLink7Description: https://datasheet.ciiva.com/46441/1703058-46441599.pdf?src-supplier=Element14; RoHS Compliant: Yes; Weight: 2.3E-05oz; Packaging: Tape and Reel; Min Operating Temperature: -55°C; Width: 0.02inch; Package Quantity: 10; ComponentLink3URL: https://datasheet.ciiva.com/2498/crcwhpe3-2498718.pdf?src-supplier=Digi-Key; Design Item ID: CRCW0402100KFKEDHP; ComponentLink4Description: https://datasheet.ciiva.com/8982/crcwhpe3-8982553.pdf?src-supplier=Avnet; Resistor Type: Thick Film; Contact Plating: Tin; ComponentLink6Description: https://datasheet.ciiva.com/5548/crcwhpe3-46056-5548557.pdf?src-supplier=Mouser; ComponentLink3Description: https://datasheet.ciiva.com/2498/crcwhpe3-2498718.pdf?src-supplier=Digi-Key; Termination: SMD/SMT; Pricing 1: 10000=0.01543 (USD); ComponentLink5Description: https://datasheet.ciiva.com/48525/crcwhpe3-48525582.pdf?src-supplier=Avnet; Length: 1mm; Max Operating Temperature: 155°C; Case Code (Imperial): 0402; ComponentLink2URL: https://datasheet.ciiva.com/2498/crcwhpe3-2498717.pdf?src-supplier=Digi-Key; ComponentLink6URL: https://datasheet.ciiva.com/5548/crcwhpe3-46056-5548557.pdf?src-supplier=Mouser; ComponentLink2Description: https://datasheet.ciiva.com/2498/crcwhpe3-2498717.pdf?src-supplier=Digi-Key; Radiation Hardening: No; Resistance Tolerance: 1%; Description 1: Res Thick Film 0402 100K Ohm 1% 0.2W(1/5W) ±100ppm/C Pad SMD Automotive T/R; ComponentLink7URL: https://datasheet.ciiva.com/46441/1703058-46441599.pdf?src-supplier=Element14; Power Rating: 125mW; Source: ICNS_PropheseeLib.SchLib; Category: Chip SMD Resistors; Voltage Rating: 50V; Number of Terminations: 2; Stock 1: 96553; Manufacturer Part Number 1: CRCW0402100KFKEDHP; ComponentLink1Description: https://datasheet.ciiva.com/2498/crcwhpe3-2498716.pdf?src-supplier=Digi-Key; ComponentLink4URL: https://datasheet.ciiva.com/8982/crcwhpe3-8982553.pdf?src-supplier=Avnet; Technology: THICK FILM; Case/Package: 0402; Depth: 0.5mm
R36 = CMP-006-000018-1: Chip Resistor Automotive Grade Thick Film 0603 150Ohm 1% Paper T/R; Manufacturer: Yageo; Power Rating: 100mW; Value: 150R; Source: ICNS_PropheseeLib.SchLib; Tolerance: 1%; Case Code (Metric): 1608; RoHS: Yes; Pricing: 1=0.10000, 10=0.02900, 100=0.01170, 1000=0.00527, 2500=0.00458, 5000=0.00378 (USD); Design Item ID: AC0603FR-10150RL; Case Code (Imperial): 0603; Stock: 17930; Category: Chip SMD Resistors; RoHS Compliant: Yes; Manufacturer Part Number: AC0603FR-10150RL
R37 = CMP-006-000021-1: Res Thick Film 0201 10K Ohm 1% 0.05W(1/20W) ±200ppm/C Pad SMD Automotive T/R; Manufacturer: Yageo; Resistance: 10kR; Max Power Dissipation: 50mW; Temperature Coefficient: 200ppm/°C; Min Operating Temperature: -55°C; RoHS: Yes; Tolerance: 1%; Case/Package: 0201; Resistor Type: Thick Film; Pricing 1: 1=0.10000, 10=0.06600, 100=0.02670, 1000=0.01201, 2500=0.01042, 5000=0.00861 (USD); Design Item ID: AC0201FR-0710KL; ComponentLink1Description: http://www.yageo.com/NewPortal/yageodocoutput?fileName=/pdf/R-Chip/PYu-AC_51_RoHS_L_6.pdf&src-supplier=Digi-Key; Number of Terminations: 2; Case Code (Imperial): 0201; Source: ICNS_PropheseeLib.SchLib; Case Code (Metric): 0603; Height: 0.01inch; ComponentLink1URL: http://www.yageo.com/NewPortal/yageodocoutput?fileName=/pdf/R-Chip/PYu-AC_51_RoHS_L_6.pdf&src-supplier=Digi-Key; Width: 0.012inch; Stock 1: 698280; Length: 0.024inch; Category: Chip SMD Resistors; Features: Moisture Resistant,Automotive AEC-Q200; Packaging: Tape and Reel; Max Operating Temperature: 155°C; Manufacturer Part Number: AC0201FR-0710KL
R38 R39 = CMP-006-000019-1: Res Thick Film 0201 1K Ohm 1% 0.05W(1/20W) ±200ppm/C Pad SMD Automotive T/R; Manufacturer: Yageo; Temperature Coefficient: 200ppm/°C; Max Power Dissipation: 50mW; Resistance: 1kR; Case Code (Metric): 0603; Width: 0.012inch; ComponentLink1Description: http://www.yageo.com/NewPortal/yageodocoutput?fileName=/pdf/R-Chip/PYu-AC_51_RoHS_L_6.pdf&src-supplier=Digi-Key; Tolerance: 1%; Source: ICNS_PropheseeLib.SchLib; Manufacturer Part Number: AC0201FR-071KL; Resistor Type: Thick Film; ComponentLink1URL: http://www.yageo.com/NewPortal/yageodocoutput?fileName=/pdf/R-Chip/PYu-AC_51_RoHS_L_6.pdf&src-supplier=Digi-Key; Case Code (Imperial): 0201; Packaging: Tape and Reel; Max Operating Temperature: 155°C; Min Operating Temperature: -55°C; Height: 0.01inch; Pricing 1: 1=0.10000, 10=0.06600, 100=0.02670, 1000=0.01201, 2500=0.01042, 5000=0.00861 (USD); Case/Package: 0201; Category: Chip SMD Resistors; Stock 1: 200; Length: 0.024inch; Design Item ID: AC0201FR-071KL; Features: Moisture Resistant,Automotive AEC-Q200; RoHS: Yes; Number of Terminations: 2
SW1 SW2 = CMP-012-000002-1: Switch Tactile N.O. SPST Round Button Gull Wing 0.05A 12VDC 1.5N SMD Embossed T/R; Manufacturer: Omron; Current Rating: 50mA; Voltage Rating (DC): 12V; Electrical Life: 200000Cycles; Actuator Length: 0.4mm; Actuator Type: Standard; Switch Travel: 0.15mm; Contact Resistance: 100mR; Ratings: Dust Proof; Illumination Type: Non-Illuminated,Illuminated; Switch Function: Off-Mom; Min Operating Temperature: -25°C; Max Operating Temperature: 70°C; Throw Configuration: SPST; RoHS Compliant: Yes; Max Current Rating: 50mA; ComponentLink3URL: https://datasheet.ciiva.com/2901/b3u-1110-2901098.pdf?src-supplier=Digi-Key; ComponentLink5URL: https://datasheet.ciiva.com/22696/60838-22696216.pdf?src-supplier=Element14; Contact Plating: Silver; Design Item ID: B3U-1100P; REACH SVHC: Unknown; ComponentLink2Description: https://datasheet.ciiva.com/2901/b3u-1110-2901097.pdf?src-supplier=Digi-Key; ComponentLink9URL: https://datasheet.ciiva.com/1532/60838-1532684.pdf?src-supplier=Element14; Package Quantity: 1; Contact Current Rating: 50mA; Max Voltage Rating (DC): 12V; Mechanical Life: 200000Cycles; Length: 3.15mm; Packaging: Tape and Reel; ComponentLink8URL: https://datasheet.ciiva.com/16155/en-b3u-16155023.pdf?src-supplier=Onlinecomponents.com; ComponentLink6Description: https://datasheet.ciiva.com/14142/b3u-eng-datasheet-14142541.pdf?src-supplier=Distrelec; ComponentLink9Description: https://datasheet.ciiva.com/1532/60838-1532684.pdf?src-supplier=Element14; Source: ICNS_PropheseeLib.SchLib; ComponentLink1URL: https://datasheet.ciiva.com/1634/60838-1634404.pdf?src-supplier=Farnell; Operating Force: 1.5N; Manufacturer Part Number: B3U-1100P; Category: Tactile Switches; Series: B3U; RoHS: Yes; Lead Free: Lead Free; ComponentLink7URL: https://datasheet.ciiva.com/30197/en-b3u-30197271.pdf?src-supplier=Onlinecomponents.com; ComponentLink8Description: https://datasheet.ciiva.com/16155/en-b3u-16155023.pdf?src-supplier=Onlinecomponents.com; ComponentLink7Description: https://datasheet.ciiva.com/30197/en-b3u-30197271.pdf?src-supplier=Onlinecomponents.com; Orientation: Straight; Mount: Surface Mount; ComponentLink4Description: https://datasheet.ciiva.com/2901/b3u-1110-2901099.pdf?src-supplier=Digi-Key; ComponentLink5Description: https://datasheet.ciiva.com/22696/60838-22696216.pdf?src-supplier=Element14; ComponentLink4URL: https://datasheet.ciiva.com/2901/b3u-1110-2901099.pdf?src-supplier=Digi-Key; Weight: 0.022g; ComponentLink3Description: https://datasheet.ciiva.com/2901/b3u-1110-2901098.pdf?src-supplier=Digi-Key; Termination: SMD/SMT; Stock 1: 18128; ComponentLink2URL: https://datasheet.ciiva.com/2901/b3u-1110-2901097.pdf?src-supplier=Digi-Key; Depth: 4mm; Pricing 1: 1=1.01000, 10=0.97300, 25=0.90960, 100=0.78980, 250=0.71864, 500=0.66626, 1000=0.65502 (USD); ComponentLink6URL: https://datasheet.ciiva.com/14142/b3u-eng-datasheet-14142541.pdf?src-supplier=Distrelec; ComponentLink1Description: https://datasheet.ciiva.com/1634/60838-1634404.pdf?src-supplier=Farnell
U1 = CMP-005-000007-1: Cyclone V SE Family FPGA, 1.07 to 1.13 V Supply, 145 I/O Pins, 6 PLLs, 672-Pin UBGA, Speed Grade 7, Industrial Grade, RoHS Compliant; Manufacturer: Altera; Speed Grade: 7; Logic Elements (LE) (K): 110; NexusDeviceID: 5CSEBA6U23I7N; Voltage Supply: 1.07 to 1.13 V; ComponentLink5Description: Device Pin-Out URL; ComponentLink3URL: http://www.altera.com/devicepackaging/04R00437-01.pdf; Code_JEDEC: MO-216; ComponentLink1URL: http://www.altera.com; DatasheetVersion: Rev. 3.4; ComponentLink6Description: Product URL; PackageReference: UBGA672_A-185; PackageDescription: 672-Pin Ultra FineLine Ball-Grid Array (UBGA), Body 23 x 23 mm, Pitch 0.8 mm; PackageVersion: Rev. 2.0, 12/2012; ComponentLink5URL: http://www.altera.com/literature/dp/cyclone-v/5CSEBA6.xls; ComponentLink4URL: http://www.altera.com/literature/hb/cyclone-v/cyclone5_handbook.pdf; ComponentLink4Description: Device Handbook URL; PartNumber: 5CSEBA6U23I7N; ComponentLink2URL: http://www.altera.com/literature/hb/cyclone-v/cv_51002.pdf; ComponentLink1Description: Manufacturer URL; RoHS: RoHS Compliant; Device Group: 5CSEBA6; ComponentLink3Description: Package Specification; ComponentLink2Description: Datasheet; Subcategory: Cyclone V SE; ComponentLink6URL: http://www.buyaltera.com/scripts/partsearch.dll?Detail&name=5CSEBA6U23I7N-ND; Mounting Technology: Surface Mount; Design Item ID: 5CSEBA6U23I7N; Source: ICNS_PropheseeLib.SchLib